# Altium project Breakout_24pin.PrjPcb
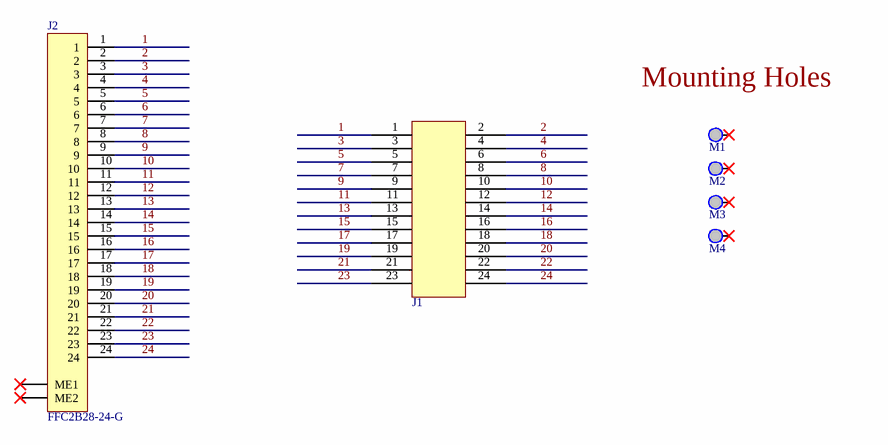
[diagram p0: Main.SchDoc]
ProjectName: Breakout_24pin; Rev: A
1 sheet, 6 parts. Net scope: global (net labels, ports and power ports of the same name join across sheets).
Board file: Breakout_24pin.PcbDoc

## Sheet Main.SchDoc: Main
size A3; Organization: INTERCREATE; Address1: 2415 3RD ST. SUITE #232; Address2: SAN FRANCISCO CA 94107; Revision: A; SheetNumber: 1; SheetTotal: 1; ProjectName: KAGWERKS COMMAND CENTER

### Parts
J1  61302421121  [HDR-V-2X12-M-TH]  (value not drawn)
J2  FFC2B28-24-G  [CONN-FFC-H-24P-0.5MM]
M1  MTG_HOLE  [MH_P_2.5MM]  (value not drawn)  (no BOM)
M2  MTG_HOLE  [MH_P_2.5MM]  (value not drawn)  (no BOM)
M3  MTG_HOLE  [MH_P_2.5MM]  (value not drawn)  (no BOM)
M4  MTG_HOLE  [MH_P_2.5MM]  (value not drawn)  (no BOM)

### Nets
1: J1.1 J2.1
2: J1.2 J2.2
3: J1.3 J2.3
4: J1.4 J2.4
5: J1.5 J2.5
6: J1.6 J2.6
7: J1.7 J2.7
8: J1.8 J2.8
9: J1.9 J2.9
10: J1.10 J2.10
11: J1.11 J2.11
12: J1.12 J2.12
13: J1.13 J2.13
14: J1.14 J2.14
15: J1.15 J2.15
16: J1.16 J2.16
17: J1.17 J2.17
18: J1.18 J2.18
19: J1.19 J2.19
20: J1.20 J2.20
21: J1.21 J2.21
22: J1.22 J2.22
23: J1.23 J2.23
24: J1.24 J2.24

Not connected (* = marked no-connect by the designer): J2 ME1* ME2*; M1 1*; M2 1*; M3 1*; M4 1*

### Notes on the sheet
- (near M1) Mounting Holes
- Title
- Size:
- Date:
- A3
- Number:
- Time:
- Revision:
- Sheet
- of
- File:

### Library data of the parts
J1 = HDR-V-2X12-M: THT Vertical Pin Header WR-PHD, Pitch 2.54 mm, Dual Row, 24 pins; Manufacturer 1: Wurth Electronics; Number of Positions: 24; Gender: Male; Connector Type: Male Pin; Pitch: 0.1inch; Supplier 1: Digi-Key; Manufacturer Part Number 1: 61302421121; RoHS: Yes; Category: Connectors; Stock 1: 2450; Pricing 1: 1=1.53000, 10=1.29800, 25=1.08200, 50=0.90100, 100=0.82000, 500=0.74500 (USD); Mount: Through Hole; Contact Plating: Gold; Contact Material: Copper; Color: Black; Number of Rows: 2; Packaging: Bulk; Termination: Solder; Number of Contacts: 24; Row Spacing: 0.1inch; Contact Mating Length: 0.236inch; REACH SVHC: Unknown; RoHS Compliant: Yes; ComponentLink1URL: https://datasheet.ciiva.com/28505/1442180-28505694.pdf?src-supplier=Element14; ComponentLink1Description: https://datasheet.ciiva.com/28505/1442180-28505694.pdf?src-supplier=Element14; Supplier Part Number 1: 732-5303-ND
J2 = CONN-FFC-H-24P-0.5MM: 24W, 0.5MM Ffc Con, R/a, Dual Cont,; Manufacturer 1: Global Connector Technology; Supplier 1: Newark; Manufacturer Part Number 1: FFC2B28-24-G; RoHS: No; Category: Connectors; Stock 1: 4000; Pricing 1: 1=0.848, 250=0.652, 500=0.587, 1000=0.534, 4000=0.534, 5000=0.489 (USD); Supplier Part Number 1: 90AJ6017
M1-M4 = MTG_HOLE: MTG HOLE PLATED VARIOUS SIZES

## Assembly variants
Mfg: not fitted J1